# EAGLE design BaliseEmetteur (EAGLE 6.5.0)
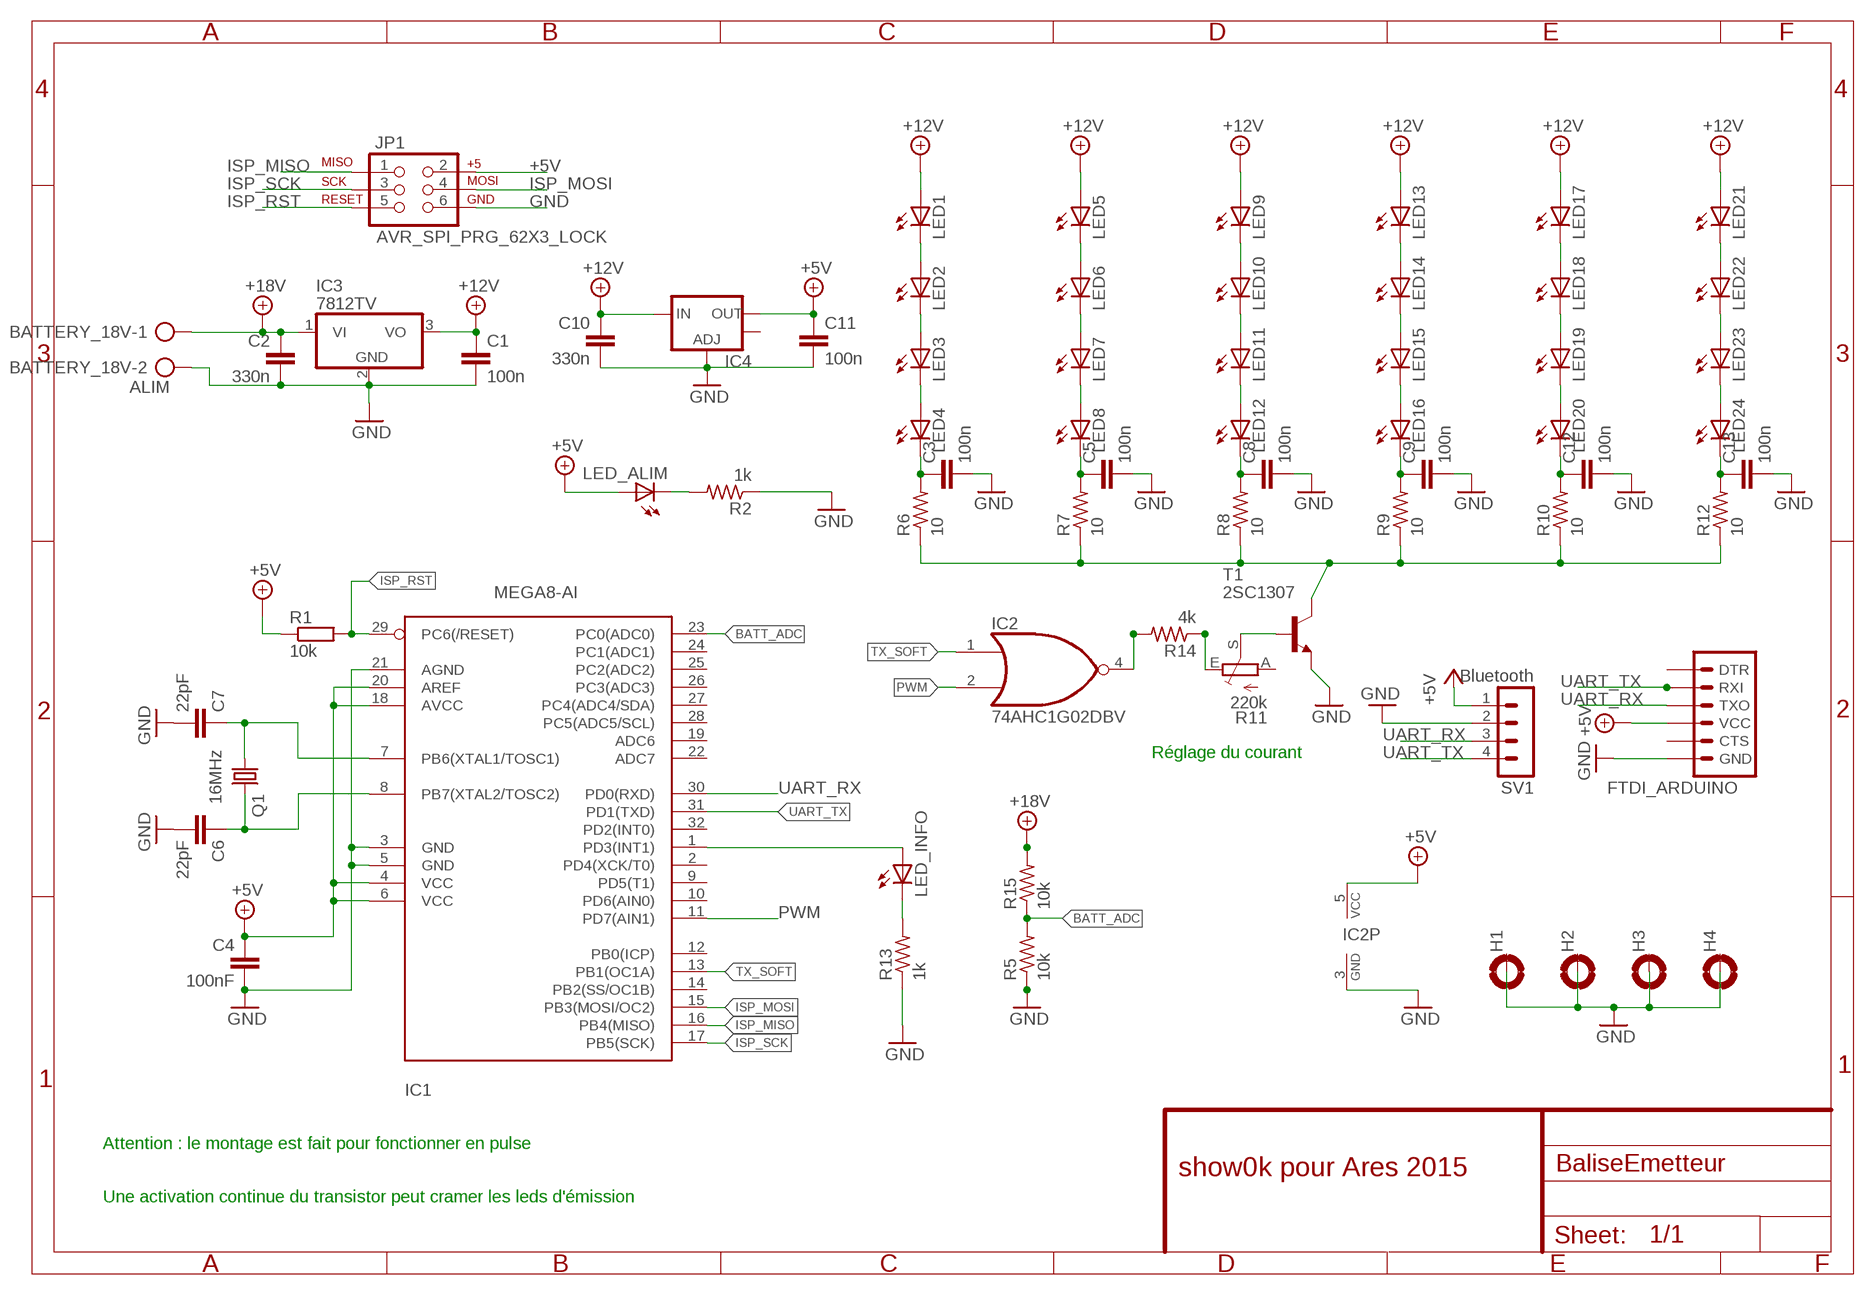
[diagram p0: schematic, sheet 1]

## Parts
BATTERY_18V  ALIM  AK500/2  [AK500/2]
C1  100n  C-EUC0805  [C0805]
C2  330n  C-EUC0805  [C0805]
C3  100n  C-EUC0805  [C0805]
C4  100nF  C-EUC0805  [C0805]
C5  100n  C-EUC0805  [C0805]
C6  22pF  C-EUC0805  [C0805]
C7  22pF  C-EUC0805  [C0805]
C8  100n  C-EUC0805  [C0805]
C9  100n  C-EUC0805  [C0805]
C10  330n  C-EUC0805  [C0805]
C11  100n  C-EUC0805  [C0805]
C12  100n  C-EUC0805  [C0805]
C13  100n  C-EUC0805  [C0805]
FTDI_ARDUINO  ARDUINO_SERIAL_PROGRAMPTH  [1X06]
H1  MOUNT-PAD-ROUND3.2  [3,2-PAD]
H2  MOUNT-PAD-ROUND3.2  [3,2-PAD]
H3  MOUNT-PAD-ROUND3.2  [3,2-PAD]
H4  MOUNT-PAD-ROUND3.2  [3,2-PAD]
IC1  MEGA8-AI  [TQFP32-08]
IC2  74AHC1G02DBV  [SOT23-5]
IC3  7812TV  [TO220V]
IC4  V_REG_LM1117SOT223  [SOT223]
JP1  AVR_SPI_PRG_62X3_LOCK  [2X3_LOCK]
LED1  LEDB155  [Q62902-B155]
LED2  LEDB155  [Q62902-B155]
LED3  LEDB155  [Q62902-B155]
LED4  LEDB155  [Q62902-B155]
LED5  LEDB155  [Q62902-B155]
LED6  LEDB155  [Q62902-B155]
LED7  LEDB155  [Q62902-B155]
LED8  LEDB155  [Q62902-B155]
LED9  LEDB155  [Q62902-B155]
LED10  LEDB155  [Q62902-B155]
LED11  LEDB155  [Q62902-B155]
LED12  LEDB155  [Q62902-B155]
LED13  LEDB155  [Q62902-B155]
LED14  LEDB155  [Q62902-B155]
LED15  LEDB155  [Q62902-B155]
LED16  LEDB155  [Q62902-B155]
LED17  LEDB155  [Q62902-B155]
LED18  LEDB155  [Q62902-B155]
LED19  LEDB155  [Q62902-B155]
LED20  LEDB155  [Q62902-B155]
LED21  LEDB155  [Q62902-B155]
LED22  LEDB155  [Q62902-B155]
LED23  LEDB155  [Q62902-B155]
LED24  LEDB155  [Q62902-B155]
LED_ALIM  LEDCHIPLED_0805  [CHIPLED_0805]
LED_INFO  LEDCHIPLED_0805  [CHIPLED_0805]
Q1  16MHz  CRYSTALHC49S  [HC49/S]
R1  10k  R-EU_0207/2V  [0207/2V]
R2  1k  R-US_M0805  [M0805]
R5  10k  R-US_M0805  [M0805]
R6  10  R-US_M0805  [M0805]
R7  10  R-US_M0805  [M0805]
R8  10  R-US_M0805  [M0805]
R9  10  R-US_M0805  [M0805]
R10  10  R-US_M0805  [M0805]
R11  220k  TRIM_EU-CA9V  [CA9V]
R12  10  R-US_M0805  [M0805]
R13  1k  R-US_M0805  [M0805]
R14  4k  R-US_M0805  [M0805]
R15  10k  R-US_M0805  [M0805]
SV1  Bluetooth  MA04-1  [MA04-1]
T1  2SC1307  [TO220AV]

## Nets
+5V: C4.1 C11.1 FTDI_ARDUINO.4(VCC) IC1.4(VCC) IC1.6(VCC) IC1.18(AVCC) IC1.20(AREF) IC2.5(VCC) IC4.2(OUT) JP1.2 LED_ALIM.A R1.1 SV1.1
+12V: C1.1 C10.1 IC3.3(VO) IC4.3(IN) LED1.A LED5.A LED9.A LED13.A LED17.A LED21.A
+18V: BATTERY_18V.1 C2.1 IC3.1(VI) R15.2
BATT_ADC: IC1.23(PC0(ADC0)) R5.2 R15.1
GND: BATTERY_18V.2 C1.2 C2.2 C3.2 C4.2 C5.2 C6.2 C7.2 C8.2 C9.2 C10.2 C11.2 C12.2 C13.2 FTDI_ARDUINO.6(GND) H1.B3,2(MOUNT) H2.B3,2(MOUNT) H3.B3,2(MOUNT) H4.B3,2(MOUNT) IC1.3(GND) IC1.5(GND) IC1.21(AGND) IC2.3(GND) IC3.2(GND) IC4.1(ADJ) JP1.6 R2.1 R5.1 R13.1 SV1.2 T1.3(E)
ISP_MISO: IC1.16(PB4(MISO)) JP1.1
ISP_MOSI: IC1.15(PB3(MOSI/OC2)) JP1.4
ISP_RST: IC1.29(PC6(/RESET)) JP1.5 R1.2
ISP_SCK: IC1.17(PB5(SCK)) JP1.3
N$1: LED_INFO.C R13.2
N$2: LED1.K(C) LED2.A
N$3: IC2.4(O) R14.2
N$4: IC1.1(PD3(INT1)) LED_INFO.A
N$5: LED3.K(C) LED4.A
N$6: LED6.K(C) LED7.A
N$7: LED5.K(C) LED6.A
N$8: C7.1 IC1.7(PB6(XTAL1/TOSC1)) Q1.1
N$9: C6.1 IC1.8(PB7(XTAL2/TOSC2)) Q1.2
N$10: LED7.K(C) LED8.A
N$11: LED18.K(C) LED19.A
N$12: LED9.K(C) LED10.A
N$13: LED2.K(C) LED3.A
N$14: LED11.K(C) LED12.A
N$15: R11.E R14.1
N$16: LED13.K(C) LED14.A
N$17: R6.1 R7.1 R8.1 R9.1 R10.1 R12.1 T1.2(C)
N$18: LED15.K(C) LED16.A
N$20: LED22.K(C) LED23.A
N$21: LED17.K(C) LED18.A
N$22: LED19.K(C) LED20.A
N$23: C3.1 LED4.K(C) R6.2
N$24: LED21.K(C) LED22.A
N$25: LED10.K(C) LED11.A
N$26: LED23.K(C) LED24.A
N$27: C5.1 LED8.K(C) R7.2
N$28: LED14.K(C) LED15.A
N$29: C8.1 LED12.K(C) R8.2
N$30: C9.1 LED16.K(C) R9.2
N$32: C12.1 LED20.K(C) R10.2
N$33: C13.1 LED24.K(C) R12.2
N$34: LED_ALIM.C R2.2
PWM: IC1.11(PD7(AIN1)) IC2.2(I1)
TIP122: R11.S T1.1(B)
TX_SOFT: IC1.13(PB1(OC1A)) IC2.1(I0)
UART_RX: FTDI_ARDUINO.3(TXO) IC1.30(PD0(RXD)) SV1.3
UART_TX: FTDI_ARDUINO.2(RXI) IC1.31(PD1(TXD)) SV1.4
Unconnected: FTDI_ARDUINO.1(DTR) FTDI_ARDUINO.5(CTS) IC1.2(PD4(XCK/T0)) IC1.9(PD5(T1)) IC1.10(PD6(AIN0)) IC1.12(PB0(ICP)) IC1.14(PB2(SS/OC1B)) IC1.19(ADC6) IC1.22(ADC7) IC1.24(PC1(ADC1)) IC1.25(PC2(ADC2)) IC1.26(PC3(ADC3)) IC1.27(PC4(ADC4/SDA)) IC1.28(PC5(ADC5/SCL)) IC1.32(PD2(INT0)) IC4.4(OUT) R11.A

## Notes on the sheet
- Réglage du courant
- Attention : le montage est fait pour fonctionner en pulse
- show0k pour Ares 2015
- Une activation continue du transistor peut cramer les leds d'émission

## Library data of the parts
BATTERY_18V = con-ptr500:AK500/2: CONNECTOR
C1-C13 = rcl:C-EU: CAPACITOR, European symbol
FTDI_ARDUINO = SparkFun-Connectors:ARDUINO_SERIAL_PROGRAM: FTDI connector footprints
H1-H4 = holes:MOUNT-PAD-ROUND: MOUNTING PAD, round
IC1 = atmel:MEGA8: MICROCONTROLLER 8 Kbytes FLASH, 1 kbytes SRAM, 512 bytes EEPROM, USART, 6-channel 10 bit ADC, 2-channel 8 bit ADC Pin compatible with Atmega48, ATMega88, ATMega168 Source: avr.lbr
IC2 = 74xx-little-us:74*1G02: 2-input NOR gate
IC3 = linear:78*: Positive VOLTAGE REGULATOR Source: http://cache.national.com/ds/LM/LM78L05.pdf http://www.fairchildsemi.com/ds/LM/LM7805.pdf
IC4 = SparkFun-PowerIC:V_REG_LM1117: Voltage Regulator LM1117 Standard adjustable voltage regulator but in SMD form. Spark Fun Electronics SKU : COM-00595
JP1 = SparkFun-Connectors:AVR_SPI_PRG_6: AVR ISP 6 Pin This is the reduced ISP connector for AVR programming. Common on Arduino. This footprint will take up less PCB space and can be used with a 10-pin to 6-pin adapter such as SKU: BOB-08508 **Special note about "TEST_POINT" package. The stop mask is on the top side, so if you want your programming test points to be on the bottom of your board, make sure to place this package on the bottom side of the board. This also ensure that the orientation to program from the bottom side will be correct.
LED1-LED24 = led:LED: LED
LED_ALIM LED_INFO = adafruit:LED: LED
Q1 = adafruit:CRYSTAL: CRYSTAL; OC_FARNELL: 1667008; OC_NEWARK: unknown
R1 = rcl:R-EU_: RESISTOR, European symbol
R2 R5-R10 R12-R15 = adafruit:R-US_: RESISTOR, American symbol
R11 = pot:TRIM_EU-: POTENTIOMETER
SV1 = con-lstb:MA04-1: PIN HEADER; OC_FARNELL: unknown; OC_NEWARK: unknown
T1 = transistor:2SC1307: NPN Transistor Silicon Epitaxial, High Frequency Power Amplifier Source: 2SC1307.pdf

## Board
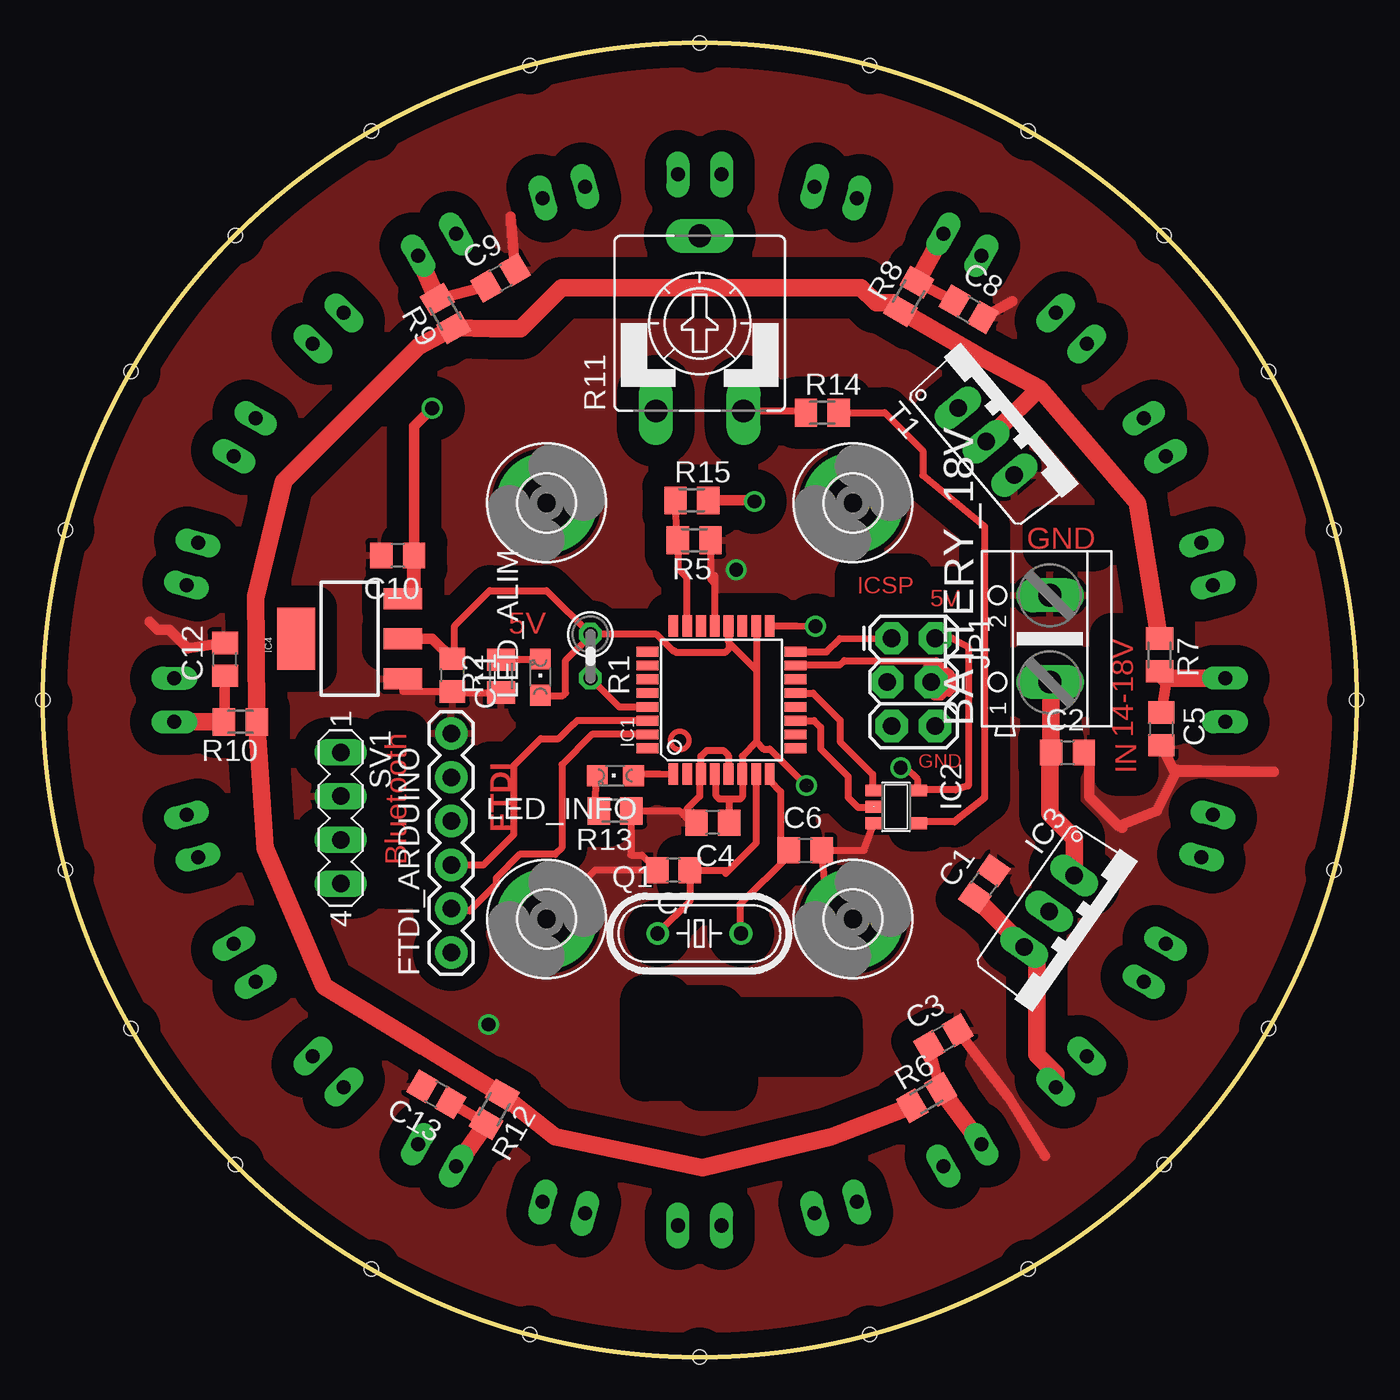
[diagram p1: board, top side]
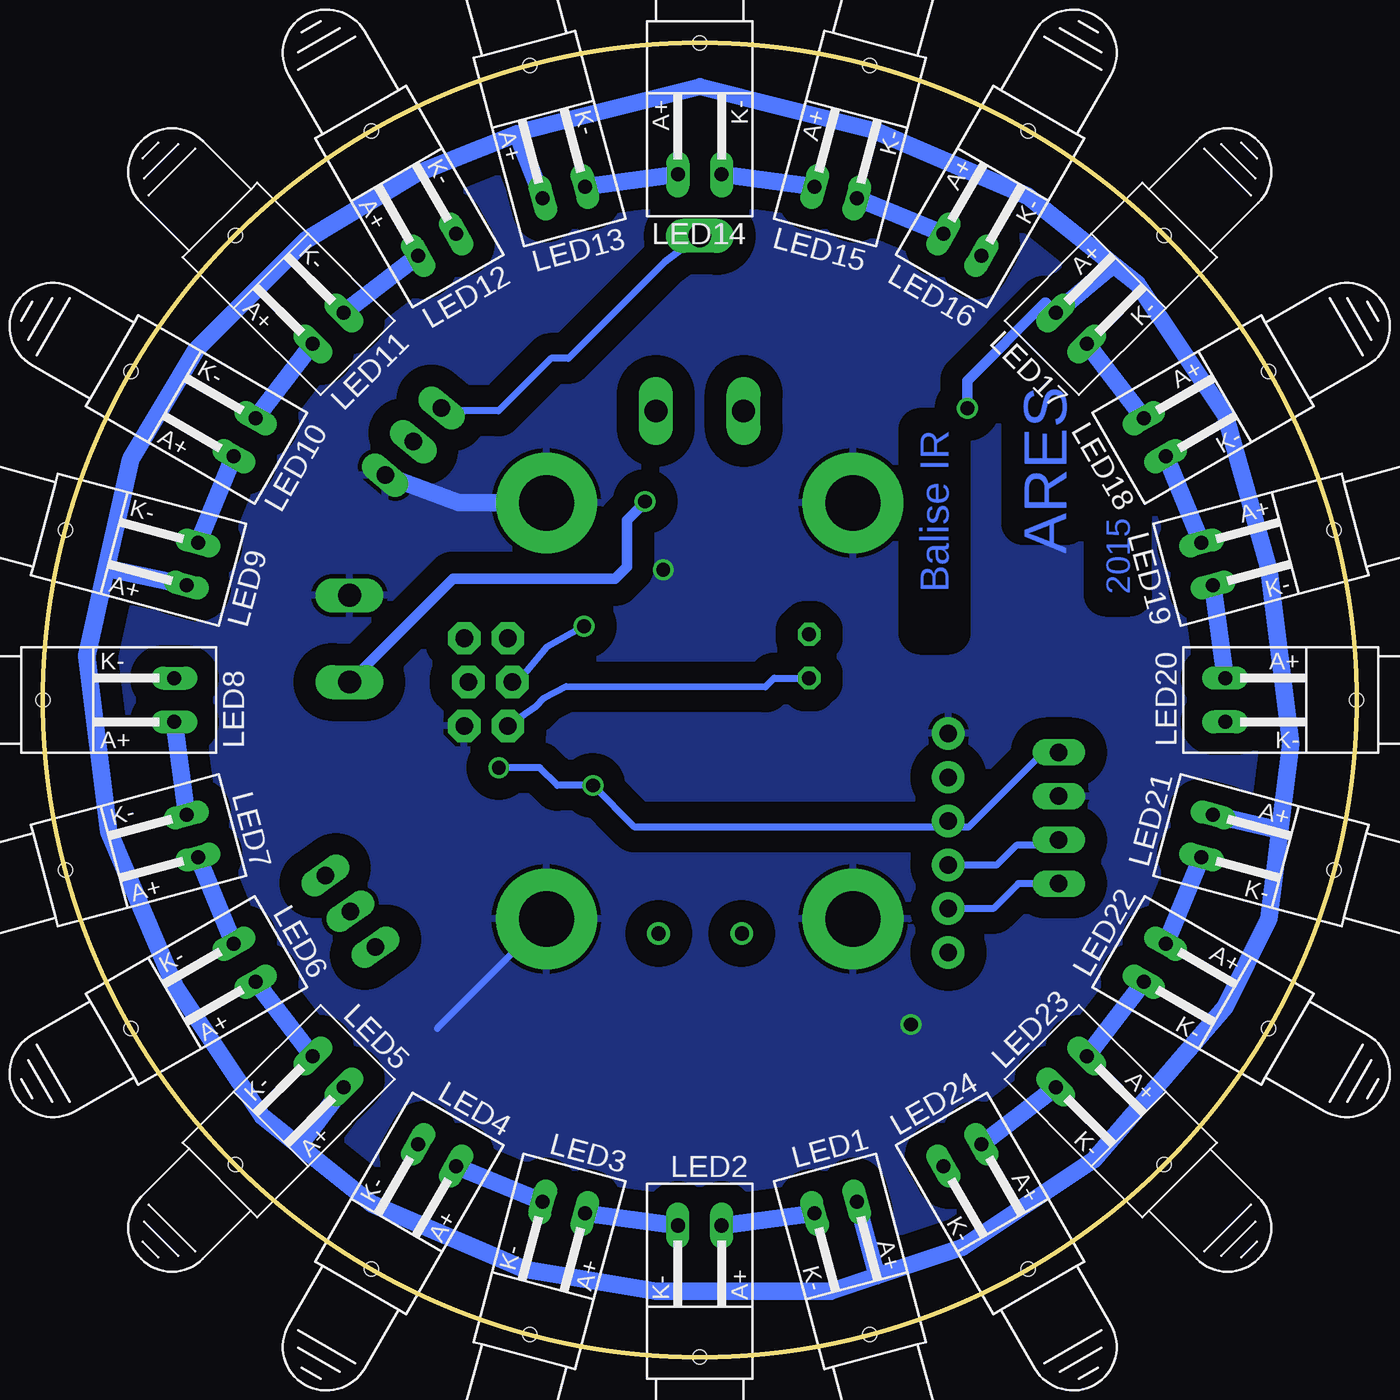
[diagram p2: board, bottom side, seen from below]

Size 76.2 x 76.2 mm. Coordinates in mm from the lower left corner, seen from the top.
Outline: circle at 38.1,38.1 radius 38.1
Copper layers (1*16): Top 0.1mm / dielectric 1.5mm / Bottom 0.1mm
Design rules "ensea *": minimum track width 0.5mm, minimum drill 0.5mm, track to track 0.5mm, track to pad 0.5mm, pad to pad 0.5mm, via to via 0.5mm, smd to smd 8mil, copper to edge 40mil, drill to drill 8mil, minimum pad ring 10mil, minimum via ring 8mil, stop-mask expansion 4mil, vias tented up to drill 0mil, thermal gap 10mil
tRestrict: area 35,15.7 to 46.1,20.7

### Footprints (pad centres in the part's own frame; a part is rotated, then mirrored left to right if it is on the bottom)
AK500/2 = drill 1.321 long: 1 -2.515,0; 2 2.515,0
C0805 = smd 1.3 x 1.5: 1 -0.95,0; 2 0.95,0
1X06 = drill 1.016 pad 1.88: 1 0,0; 2 2.54,0; 3 5.08,0; 4 7.62,0; 5 10.16,0; 6 12.7,0
3,2-PAD = drill 3.2 pad 5.842: B3,2 0,0
TQFP32-08 = smd 1.27 x 0.559: 1 -4.293,2.8; 2 -4.293,2; 3 -4.293,1.2; 4 -4.293,0.4; 5 -4.293,-0.4; 6 -4.293,-1.2; 7 -4.293,-2; 8 -4.293,-2.8; 17 4.293,-2.8; 18 4.293,-2; 19 4.293,-1.2; 20 4.293,-0.4; 21 4.293,0.4; 22 4.293,1.2; 23 4.293,2; 24 4.293,2.8 | smd 0.559 x 1.27: 9 -2.8,-4.293; 10 -2,-4.293; 11 -1.2,-4.293; 12 -0.4,-4.293; 13 0.4,-4.293; 14 1.2,-4.293; 15 2,-4.293; 16 2.8,-4.293; 25 2.8,4.293; 26 2,4.293; 27 1.2,4.293; 28 0.4,4.293; 29 -0.4,4.293; 30 -1.2,4.293; 31 -2,4.293; 32 -2.8,4.293
SOT23-5 = smd 0.69 x 0.99: 1 -0.95,-1.29; 2 0,-1.29; 3 0.95,-1.29; 4 0.95,1.3; 5 -0.95,1.3
TO220V = drill 1.016 long: 1 -2.54,-2.54; 2 0,-2.54; 3 2.54,-2.54
SOT223 = smd 1.219 x 2.235: 1 -2.311,-3.099; 2 0,-3.099; 3 2.311,-3.099 | smd 3.6 x 2.2: 4 0,3.099
2X3_LOCK = drill 1.016 pad 1.88 octagon: 1 0,0; 2 0,2.54; 3 2.54,-0.254; 4 2.54,2.286; 5 5.08,0; 6 5.08,2.54
Q62902-B155 = drill 0.813 long: A 7.62,-1.27; K 7.62,1.27 | hole 0.813: 0,0
CHIPLED_0805 = smd 1.2 x 1.2: A 0,-1.05; C 0,1.05
HC49/S = drill 0.813: 1 -2.413,0; 2 2.413,0
0207/2V = drill 0.813 octagon: 1 -1.27,0; 2 1.27,0
M0805 = smd 1.3 x 1.6: 1 -0.95,0; 2 0.95,0
CA9V = drill 1.321 long: A -2.54,-5.08; E 2.54,-5.08; S 0,5.08
MA04-1 = drill 1.016 long: 1 -3.81,0; 2 -1.27,0; 3 1.27,0; 4 3.81,0
TO220AV = drill 1.016 long: 1 -2.54,-2.54; 2 0,-2.54; 3 2.54,-2.54

### Placement (x,y rotation side)
BATTERY_18V  58.42,41.66 90 top
C1  54.61,27.43 55 top
C2  59.44,35.05 0 top
C3  52.23,18.47 30 top
C4  38.86,30.99 180 top
C5  64.87,36.42 270 top
C6  44.22,29.38 0 top
C7  36.58,28.23 180 top
C8  53.71,60.76 330 top
C9  26.55,62.58 30 top
C10  20.57,46.48 180 top
C11  23.75,39.54 270 top
C12  10.56,40.46 90 top
C13  22.82,15.22 150 top
FTDI_ARDUINO  23.68,23.46 90 top
H1  46.99,49.53 0 top
H2  29.21,49.53 0 top
H3  46.99,25.4 0 top
H4  29.21,25.4 0 top
IC1  39.37,38.1 90 top
IC2  49.49,31.9 270 top
IC3  60.45,24.38 235 top
IC4  17.78,41.66 90 top
JP1  49.23,41.68 270 top
LED1  28.24,1.3 105 bottom
LED2  38.1,0 90 bottom
LED3  47.96,1.3 75 bottom
LED4  57.15,5.1 60 bottom
LED5  65.04,11.16 45 bottom
LED6  71.1,19.05 30 bottom
LED7  74.9,28.24 15 bottom
LED8  76.2,38.1 0 bottom
LED9  74.9,47.96 345 bottom
LED10  71.1,57.15 330 bottom
LED11  65.04,65.04 315 bottom
LED12  57.15,71.1 300 bottom
LED13  47.96,74.9 285 bottom
LED14  38.1,76.2 270 bottom
LED15  28.24,74.9 255 bottom
LED16  19.05,71.1 240 bottom
LED17  11.16,65.04 225 bottom
LED18  5.1,57.15 210 bottom
LED19  1.3,47.96 195 bottom
LED20  0,38.1 180 bottom
LED21  1.3,28.24 165 bottom
LED22  5.1,19.05 150 bottom
LED23  11.16,11.16 135 bottom
LED24  19.05,5.1 120 bottom
LED_ALIM  28.85,39.43 0 top
LED_INFO  33.2,33.71 90 top
Q1  38.07,24.56 0 top
R1  31.75,40.64 270 top
R2  26.57,39.48 90 top
R5  37.77,47.37 180 top
R6  51.25,15.04 30 top
R7  64.77,40.72 270 top
R8  50.23,61.5 60 top
R9  23.35,60.51 120 top
R10  11.45,36.83 180 top
R11  38.1,59.94 0 top
R12  26.17,14.36 240 top
R13  33.18,31.67 180 top
R14  45.21,54.76 0 top
R15  37.64,49.68 0 top
SV1  17.27,31.25 270 top
T1  56.66,54.72 310 top

### Tracks (layer width: path | path; a pad name or v marks a point on that pad's centre or on a via)
+5V  (via drill 0.8)  (1 unrouted)
  Top 0.406: C11.1 23.88,40.62 23.88,42.42 25.91,44.45 29.21,44.45 R1.1 | R1.1 | JP1.2 52.73,41.68 53.69,41.18 53.69,33.12 52.94,32.89 50.83,32.89 IC2.5 50.72,32.92 50.72,33.52 50.06,34.18 v49.76,34.18 | LED_ALIM.A 28.87,38.35 30.16,38.35 30.32,38.51 30.32,40.41 31.75,41.83 R1.1 | 41.39,39.84 41.39,35.67 | 41.39,35.67 40.57,34.85 IC1.6 40.57,32.48 40.44,32.35 39.93,32.35 | IC1.18 41.39,42.37 41.39,39.84 | 41.39,39.84 39.77,41.46 IC1.20 39.8,42.37 39.8,41.08 39.56,40.84 36.74,40.84 36.64,40.95 36.56,40.95 35.59,41.91 R1.1 | 41.39,35.67 41.81,35.26 42.16,35.26 44.27,33.15 v44.3,33.14 | 39.93,32.35 39.24,32.35 39.05,32.54 39.05,33.73 IC1.4 | C4.1 39.81,32.23 39.93,32.35
  Top 0.5: 44.12,33.12 44.45,33.15 v44.3,33.14
  Top 0.61: IC4.2 22.58,41.66 C11.1
  Bottom 0.406: 44.45,33.15 46.35,33.15 47.39,34.18 v49.76,34.18 | SV1.1 18.16,35.06 22.5,30.73 23.32,30.73 | 23.32,30.73 41.88,30.73 v44.3,33.14 | 23.32,30.73 FTDI_ARDUINO.4
+12V  (via drill 0.8)
  Top 0.61: C10.1 21.52,53.97 v22.58,55.02
  Top 0.813: IC4.3 21.52,44.61 C10.1
  Top 1.016: C1.1 56.91,23.8 IC3.3 57.66,23.02 57.66,17.53 58.76,16.43 LED5.A
  Bottom 0.406: 48.26,71.12 48.7,70.94
  Bottom 0.61: v22.58,55.02 22.58,56.62 18.06,61.13 18.03,61.13 LED17.A
  Bottom 1.016: 4.43,30.56 4.77,27.9 5.08,25.4 7.62,20.32 15.24,11.43 22.86,6.35 27.81,4.7 | 4.43,30.56 3.81,35.56 5.08,45.72 7.62,54.61 12.7,62.23 14.09,63.34 | 14.09,63.34 19.05,67.31 27.94,71.12 38.1,73.66 45.87,71.72 48.26,71.12 | 72.52,45.75 73.66,40.64 72.39,30.48 68.58,21.59 63.5,13.97 61.33,12.24 | 72.52,45.75 71.99,48.17 71.12,52.07 67.31,58.42 60.96,64.77 54.61,68.58 48.7,70.94 LED13.A | 61.33,12.24 57.15,8.89 48.26,5.08 40.64,3.81 30.48,3.81 27.81,4.7 | 4.43,30.56 LED21.A | 14.09,63.34 LED17.A | 72.52,45.75 LED9.A | 61.33,12.24 LED5.A | 27.81,4.7 LED1.A
+18V  (via drill 0.8)
  Top 0.61: R15.2 41.2,49.68 v41.27,49.61
  Top 1.016: BATTERY_18V.1 58.49,39.08 C2.1 58.42,34.99 58.42,31.5 59.83,30.09 IC3.1
  Bottom 0.61: v41.27,49.61 41.27,49.56 42.32,48.51 42.32,45.83 43.01,45.14 52.42,45.14 BATTERY_18V.1
BATT_ADC
  Top 0.406: IC1.23 37.37,45.18 36.83,45.73 R5.2 36.73,47.46 R15.1
GND  (via drill 0.8)
  Top 0.406: 38.97,45.32 38.97,44.86 | 38.97,44.86 IC1.21 | H3.B3,2 45.72,24.13 C6.2 47.64,29.38 IC2.3 | H1.B3,2 48.57,47.95 | 37.34,31.24 37.34,31.75 38.1,32.51 38.1,33.74 IC1.3 38.17,34.84 38.52,35.18 39.47,35.18 39.77,34.89 IC1.5 | 37.34,31.24 37.59,30.99 C4.2 | IC4.1 20.88,38.59 C11.2 23.81,38.53 R2.1 | H4.B3,2 32.03,28.23 C7.2 34.74,29.11 34.11,29.11 34.11,31.67 R13.1 36.91,31.67 37.34,31.24 | R5.1 38.73,45.1 38.97,44.86
  Top 0.61: C2.2 60.71,34.73 60.71,32.48 62.38,30.81 62.51,30.81 | C12.2 8.39,41.1 7.33,42.16 6.66,42.16 6.18,42.64 | C9.2 27.12,66.14 | C8.2 56.23,61.22 | C3.2 56.03,15.03 58.12,11.66 | C5.2 65.62,33.93 71.42,33.93 65.81,34.05 64.61,31.69 62.55,30.85 62.41,30.82 62.61,30.69 62.43,30.79
  Bottom 0.406: H3.B3,2 53.34,19.05
  Bottom 1.016: T1.3 52.07,49.53 H1.B3,2
  other vias: 25.85,19.28 40.22,45.65
  pour Top (isolate 1.27): 86.36,85.09 -8.89,85.09 -8.89,-12.7 86.36,-12.7
  pour Bottom (isolate 1.27): -8.89,85.09 86.36,85.09 86.36,-12.7 -8.89,-12.7
ISP_MISO
  Top 0.406: IC1.16 45.47,40.89 46.23,41.66 JP1.1
ISP_MOSI
  Top 0.406: IC1.15 43.69,40.13 46.23,40.13 46.48,40.39 51.82,40.39 52.39,39.82 52.45,39.82 52.88,39.39 52.88,38.93 52.9,38.91 52.9,38.81 52.57,38.48 52.34,38.48 52.12,38.27 51.69,38.27 51.63,38.34 51.92,38.34 52.29,38.7 52.5,38.7 52.67,38.87 52.67,39.05 52.53,39.18 52.53,39.31 52.45,39.39 52.45,39.44 52.22,39.67 52.22,39.71 | 52.22,39.71 52.02,39.91 | 52.02,39.91 51.99,39.94 51.86,39.94 51.77,40.02 51.74,40.02 51.73,40.04 51.66,40.04 51.61,40.09 51.31,40.09 51.26,40.04 51.63,40.04 51.76,39.91 52.02,39.91 | 52.22,39.71 52.48,39.44 52.48,39.06 52.52,39.03 52.52,38.91 52.34,38.73 52.34,39.34 52.67,39.67 52.05,39.67 JP1.4
ISP_RST
  Top 0.406: R1.2 33.42,37.7 IC1.29
  Bottom 0.406: JP1.5 47.61,37.73 47.13,38.22 45.85,38.89 34.29,38.86 33.78,39.37 R1.2
ISP_SCK  (via drill 0.8)
  Top 0.406: IC1.17 43.72,42.39 v44.81,42.38
  Bottom 0.406: v44.81,42.38 46.99,41.15 48.26,39.62 JP1.3
N$1
  Top 0.406: R13.2 31.93,31.21 LED_INFO.C
N$2
  Bottom 1.016: LED1.K LED2.A
N$3
  Top 0.406: R14.2 48.84,54.76 51.04,52.56 51.04,51.13 54.62,48.17 54.62,32.41 52.88,31.03 50.87,31.03 IC2.4
N$4
  Top 0.406: LED_INFO.A 34.28,33.81 35.77,33.81 36.35,33.81 IC1.1
N$5
  Bottom 1.016: LED3.K LED4.A
N$6
  Bottom 1.016: LED6.K LED7.A
N$7
  Bottom 1.016: LED5.K LED6.A
N$8
  Top 0.406: IC1.7 41.37,29.8 39.8,28.23 | 39.8,28.23 39.62,28.05 | 39.8,28.23 C7.1 37.53,26.42 Q1.1
N$9
  Top 0.406: IC1.8 42.17,33.41 42.78,32.79 42.78,29.86 C6.1 43.27,29.08 40.43,26.24 40.43,24.61 Q1.2
N$10
  Bottom 1.016: LED7.K LED8.A
N$11
  Bottom 1.016: LED19.A LED18.K
N$12
  Bottom 1.016: LED9.K LED10.A
N$13
  Bottom 1.016: LED2.K LED3.A
N$14
  Bottom 1.016: LED12.A LED11.K
N$15
  Top 0.406: R11.E 44.16,54.86 R14.1
N$16
  Bottom 1.016: LED14.A LED13.K
N$17
  Top 1.016: R6.1 45.76,12.78 38.27,10.97 29.71,12.78 R12.1 22.08,17.98 16.32,21.5 12.89,29.5 R10.1 12.36,41.43 12.33,44.06 13.97,50.8 21.76,58.59 R9.1 26.02,59.63 27.7,59.63 30.08,62.01 47.47,62.01 48.34,61.14 49.3,61.14 R8.1 54.2,58.11 57.82,56.19 | 57.82,56.19 63.5,49.53 R7.1 | T1.2 55.33,53.74 57.82,56.19
N$18
  Bottom 1.016: LED16.A LED15.K
N$20
  Bottom 1.016: LED23.A LED22.K
N$21
  Bottom 1.016: LED18.A LED17.K
N$22
  Bottom 1.016: LED20.A LED19.K
N$23
  Top 0.61: C3.1 R6.2
  Top 1.016: R6.2 LED4.K
N$24
  Bottom 1.016: LED22.A LED21.K
N$25
  Bottom 1.016: LED10.K LED11.A
N$26
  Bottom 1.016: LED24.A LED23.K
N$27
  Top 0.61: C5.1 65.21,39.37
  Top 1.016: R7.2 65.12,39.37 65.21,39.37 LED8.K
N$28
  Bottom 1.016: LED15.A LED14.K
N$29
  Top 0.61: R8.2 C8.1
  Top 1.016: R8.2 LED12.K
N$30
  Top 0.61: R9.2 C9.1
  Top 1.016: LED16.K R9.2
N$32
  Top 0.61: C12.1 R10.2
  Top 1.016: LED20.K | LED20.K R10.2
N$33
  Top 0.61: C13.1 R12.2
  Top 1.016: R12.2 LED24.K
N$34
  Top 0.406: R2.2 26.62,40.48 LED_ALIM.C
PWM
  Top 0.406: IC1.11 44.74,36.9 45.11,36.52 45.11,35.27 46.71,33.67 46.71,32.46 47.28,31.88 48.17,31.88 IC2.2
TIP122
  Bottom 0.406: R11.S 40.13,63.5 45.72,57.91 46.74,57.91 49.78,54.86 51.73,54.86 T1.1
TX_SOFT
  Top 0.406: IC1.13 44.67,38.5 46.24,36.93 46.24,35.69 48.13,33.8 48.13,32.92 IC2.1
UART_RX
  Top 0.406: FTDI_ARDUINO.3 25.55,28.54 27.32,30.31 27.32,34.31 28.88,35.86 29.92,35.86 30.73,36.67 30.76,36.67 31.01,36.92 35.06,36.92 IC1.30
  Bottom 0.406: FTDI_ARDUINO.3 20.86,28.54 19.7,29.7 17.55,29.7 SV1.3
UART_TX
  Top 0.406: IC1.31 31.84,36.1 30.1,34.36 30.1,29.52 29.72,29.14 27.65,29.14 26.28,27.77 26.28,27.41 24.75,25.87 23.8,25.87 FTDI_ARDUINO.2
  Bottom 0.406: SV1.4 19.63,27.44 21.07,26 FTDI_ARDUINO.2
(copper drawn outside any net)
  shapes: Top circle x1

### Text on the board
Top: GND | ICSP | 5V | 5V | Bluetooth | 14-18V | GND | IN | FTDI
Bottom: ARES | Balise IR | 2015